# Altium schematic sheet CONNECTEUR_1.SchDoc: DARKYDEN_CONNECTEUR_1
size Letter; ApprovedBy: APPROUVÉ PAR; Author: Harold Malbrouck; Organization: Cegep Limoilou; Address1: 1300, 8e Avenue; Address2: Québec, QC; Address3: Canada; Address4: G1J 5L5; Revision: Rev.B; SheetNumber: 3; SheetTotal: 21
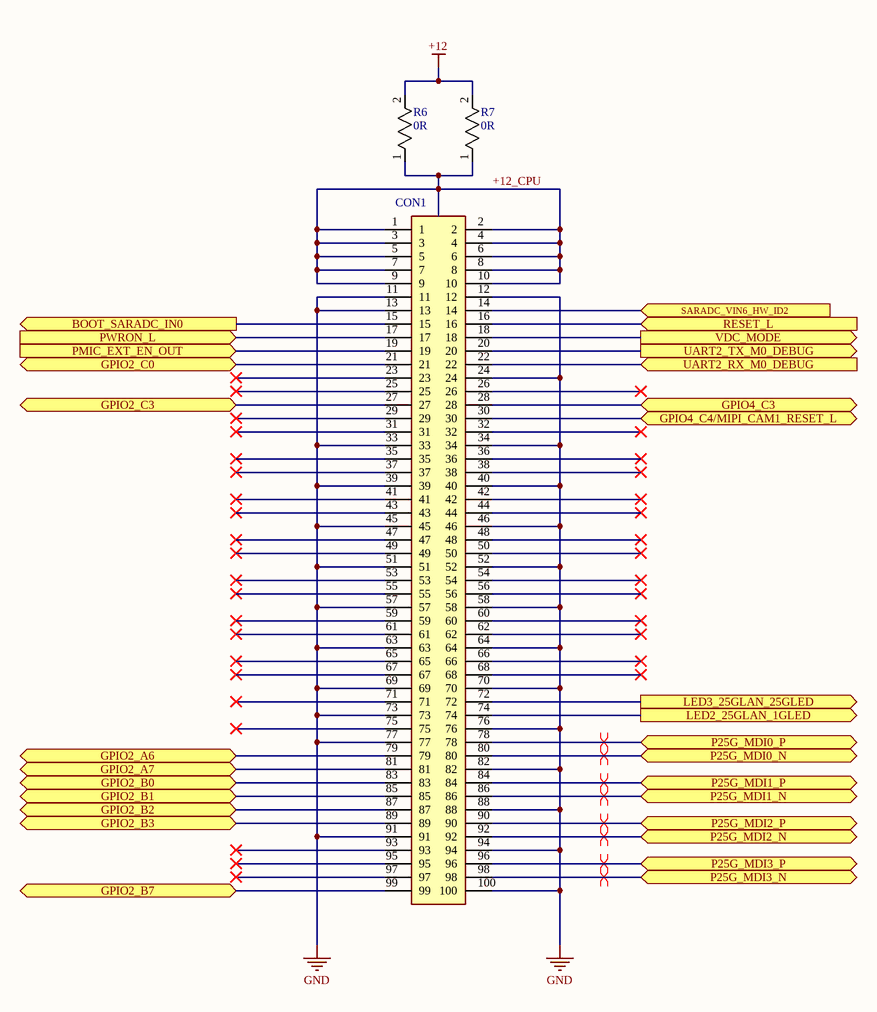
[diagram p0: CONNECTEUR_1.SchDoc]

## Parts
CON1  DF40HC  [DF40HC30100DS04V51_MOD]  (value not drawn)
R6  0R  [RESC1608X55N]
R7  0R  [RESC1608X55N]

## Ports
BOOT_SARADC_IN0 (out, see SystemCTL[1B]), GPIO2_A6 (bidir, see WIFI[1B]), GPIO2_A7 (bidir, see WIFI[1B]), GPIO2_B0 (bidir, see WIFI[1B]), GPIO2_B1 (bidir, see WIFI[1B]), GPIO2_B2 (bidir, see WIFI[1B]), GPIO2_B3 (bidir, see WIFI[1A]), GPIO2_B7 (bidir, see WIFI[3A]), GPIO2_C0 (bidir, see WIFI[3A]), GPIO2_C3 (bidir, see WIFI[3B]), GPIO4_C3 (bidir, see WIFI[3B]), GPIO4_C4/MIPI_CAM1_RESET_L (bidir, see WIFI[3B]), LED2_25GLAN_1GLED (out, see ETHERNET[3A]), LED3_25GLAN_25GLED (out, see ETHERNET[3B]), P25G_MDI0_N (bidir, see ETHERNET[2C]), P25G_MDI0_P (bidir, see ETHERNET[2B]), P25G_MDI1_N (bidir, see ETHERNET[4B]), P25G_MDI1_P (bidir, see ETHERNET[4C]), P25G_MDI2_N (bidir, see ETHERNET[2C]), P25G_MDI2_P (bidir, see ETHERNET[2C]), P25G_MDI3_N (bidir, see ETHERNET[4C]), P25G_MDI3_P (bidir, see ETHERNET[4C]), PMIC_EXT_EN_OUT (in, see 1V8_3V3_5V[1A], 1V8_3V3_5V[1C], POWER_PCie[1B], POWER_PCie[1C]), PWRON_L (in, see SystemCTL[1A]), RESET_L (in, see SystemCTL[1B]), SARADC_VIN6_HW_ID2 (in, see USB2_0_Connector[3A]), UART2_RX_M0_DEBUG (in, see SystemCTL[2D]), UART2_TX_M0_DEBUG (out, see SystemCTL[2D]), VDC_MODE (out, see SystemCTL[1D])

## Nets
+12: R6.2 R7.2
GND: CON1.11 CON1.12 CON1.13 CON1.24 CON1.33 CON1.34 CON1.39 CON1.40 CON1.45 CON1.46 CON1.51 CON1.52 CON1.57 CON1.58 CON1.63 CON1.64 CON1.69 CON1.70 CON1.73 CON1.76 CON1.77 CON1.82 CON1.88 CON1.91 CON1.94 CON1.100
+12_CPU: CON1.1 CON1.2 CON1.3 CON1.4 CON1.5 CON1.6 CON1.7 CON1.8 CON1.9 CON1.10 R6.1 R7.1
BOOT_SARADC_IN0: CON1.15 ; port BOOT_SARADC_IN0
GPIO2_A6: CON1.79 ; port GPIO2_A6
GPIO2_A7: CON1.81 ; port GPIO2_A7
GPIO2_B0: CON1.83 ; port GPIO2_B0
GPIO2_B1: CON1.85 ; port GPIO2_B1
GPIO2_B2: CON1.87 ; port GPIO2_B2
GPIO2_B3: CON1.89 ; port GPIO2_B3
GPIO2_B7: CON1.99 ; port GPIO2_B7
GPIO2_C0: CON1.21 ; port GPIO2_C0
GPIO2_C3: CON1.27 ; port GPIO2_C3
GPIO4_C3: CON1.28 ; port GPIO4_C3
GPIO4_C4/MIPI_CAM1_RESET_L: CON1.30 ; port GPIO4_C4/MIPI_CAM1_RESET_L
LED2_25GLAN_1GLED: CON1.74 ; port LED2_25GLAN_1GLED
LED3_25GLAN_25GLED: CON1.72 ; port LED3_25GLAN_25GLED
P25G_MDI0_N: CON1.80 ; port P25G_MDI0_N
P25G_MDI0_P: CON1.78 ; port P25G_MDI0_P
P25G_MDI1_N: CON1.86 ; port P25G_MDI1_N
P25G_MDI1_P: CON1.84 ; port P25G_MDI1_P
P25G_MDI2_N: CON1.92 ; port P25G_MDI2_N
P25G_MDI2_P: CON1.90 ; port P25G_MDI2_P
P25G_MDI3_N: CON1.98 ; port P25G_MDI3_N
P25G_MDI3_P: CON1.96 ; port P25G_MDI3_P
PMIC_EXT_EN_OUT: CON1.19 ; port PMIC_EXT_EN_OUT
PWRON_L: CON1.17 ; port PWRON_L
RESET_L: CON1.16 ; port RESET_L
SARADC_VIN6_HW_ID2: CON1.14 ; port SARADC_VIN6_HW_ID2
UART2_RX_M0_DEBUG: CON1.22 ; port UART2_RX_M0_DEBUG
UART2_TX_M0_DEBUG: CON1.20 ; port UART2_TX_M0_DEBUG
VDC_MODE: CON1.18 ; port VDC_MODE

Not connected (* = marked no-connect by the designer): CON1 23* 25* 26* 29* 31* 32* 35* 36* 37* 38* 41* 42* 43* 44* 47* 48* 49* 50* 53* 54* 55* 56* 59* 60* 61* 62* 65* 66* 67* 68* 71* 75* 93* 95* 97*

## Layout directives
differential pair: P25G_MDI0_N, P25G_MDI0_P, P25G_MDI1_N, P25G_MDI1_P, P25G_MDI2_N, P25G_MDI2_P, P25G_MDI3_N, P25G_MDI3_P

## Notes on the sheet
- Titre :
- Conception :
- Date :
- Approbation :
- Heure :
- Révision :
- Feuille
- de
- Fichier :

## Library data of the parts
CON1 = DF40HC(3.0)-100DS-0.4V(51): Stacking Board Connector, DF40 Series, Receptacle, 0.4 mm, 100, Surface Mount, G; Manufacturer_Name: Hirose; Number of Positions: 100; Contact Resistance: 90mR; Contact Voltage Rating (AC): 30V; Current Rating: 300mA; Mated Stacking Heights: 3mm; Contact Pitch: 400um; Datasheet Link: https://componentsearchengine.com/Datasheets/1/DF40HC(3.0)-100DS-0.4V(51.pdf; Height: 3.05mm; Mouser Part Number: 798-DF40HC30100DS451; Mouser Price/Stock: https://www.mouser.co.uk/ProductDetail/Hirose-Connector/DF40HC3.0-100DS-0.4V51?qs=%252BAZVS4b%2FkgIV%252B3vHYy2dCA%3D%3D; Arrow Part Number: DF40HC(3.0)-100DS-0.4V(51; Arrow Price/Stock: https://www.arrow.com/en/products/df40hc-3.0-100ds-0.4v-51/hirose-electric; Supplier: Digikey; Supplier Part Number: 26-DF40HC(3.0)-100DS-0.4V(51)CT-ND; Manufacturer: Hirose; Manufacturer Part Number: DF40HC(3.0)-100DS-0.4V(51; RoHS: Yes; Category: Headers and Wire Housings; Stock: 5604; Pricing: 1=2.61, 10=2.219, 25=2.0796, 50=1.9804, 100=1.8858, 250=1.76764, 500=1.68326, 1000=1.6524 (USD); Mounting Technology: Surface Mount; Contact Plating: Gold; Contact Material: Nickel,Gold; Housing Color: Black; Min Operating Temperature: -35°C; Max Operating Temperature: 85°C; Package Quantity: 3000; Packaging: Tape and Reel; Number of Rows: 2; Connector Type: Receptacle; Series: DF40; Contact Voltage Rating (DC): 30V; Number of Contacts: 100; Orientation: Straight; Voltage Rating: 30V; Length: 22.6mm; Width: 3.38mm; ComponentLink1URL: https://datasheet.ciiva.com/13559/ed-df40-20140305-13559540.pdf?src-supplier=Mouser; ComponentLink1Description: https://datasheet.ciiva.com/13559/ed-df40-20140305-13559540.pdf?src-supplier=Mouser
R6 R7 = ERJ-3GEY0R00V: Zero Ohm Resistor, Jumper, 0603 [1608 Metric], Thick Film, 100 mW, 1 A, Surface Mount; Manufacturer_Name: Panasonic; Power Rating: 100mW; Voltage Rating: 75V; Tolerance: 0%; Temperature Coefficient: 200ppm/°C; Datasheet Link: http://docs-europe.electrocomponents.com/webdocs/13ba/0900766b813ba21b.pdf; Height: 0.55mm; Mouser Part Number: 667-ERJ-3GEY0R00V; Mouser Price/Stock: https://www.mouser.co.uk/ProductDetail/Panasonic/ERJ-3GEY0R00V?qs=66DK8nO8gJALIOqOWgiVwg%3D%3D; Arrow Part Number: ERJ-3GEY0R00V; Arrow Price/Stock: https://www.arrow.com/en/products/erj3gey0r00v/panasonic?region=europe; Supplier: Digikey; Supplier Part Number: P0.0GCT-ND; Manufacturer: Panasonic; Manufacturer Part Number: ERJ-3GEY0R00V; RoHS: Yes; Category: Chip SMD Resistors; Stock: 766631; Pricing: 1=0.1, 10=0.02, 25=0.0164, 50=0.0144, 100=0.0126, 250=0.0106, 500=0.00936, 1000=0.0083 (USD); Mounting Technology: Surface Mount; Case/Package: 0603; Case Code (Metric): 1608; Case Code (Imperial): 0603; Contact Plating: Tin; Min Operating Temperature: -55°C; Max Operating Temperature: 155°C; Packaging: Tape and Reel; Package Quantity: 5000; Value: 0R; Resistor Type: Thick Film; Number of Terminations: 2; Termination: SMD/SMT; Max Power Dissipation: 100mW; Features: Automotive AEC-Q200; Series: ERJ; Construction: Rectangular; Technology: THICK FILM; Length: 1.6mm; Width: 0.8mm; Depth: 0.8mm; Ratings: AEC-Q200; Radiation Hardening: No; Reach SVHC Compliant: No; Military Standard: Not; RoHS Compliant: Yes; Lead Free: 5697LeadFree; ComponentLink1URL: https://datasheet.ciiva.com/11808/0900766b80f806dd-11808207.pdf?src-supplier=Rs; ComponentLink1Description: https://datasheet.ciiva.com/11808/0900766b80f806dd-11808207.pdf?src-supplier=Rs; ComponentLink2URL: https://datasheet.ciiva.com/27055/1935748-27055113.pdf?src-supplier=Jameco; ComponentLink2Description: https://datasheet.ciiva.com/27055/1935748-27055113.pdf?src-supplier=Jameco; ComponentLink3URL: https://datasheet.ciiva.com/5959/1678796-5959707.pdf?src-supplier=Farnell; ComponentLink3Description: https://datasheet.ciiva.com/5959/1678796-5959707.pdf?src-supplier=Farnell; ComponentLink4URL: https://datasheet.ciiva.com/43460/1678796-43460647.pdf?src-supplier=Farnell; ComponentLink4Description: https://datasheet.ciiva.com/43460/1678796-43460647.pdf?src-supplier=Farnell; ComponentLink5URL: https://datasheet.ciiva.com/48532/aoa0000ce1-48532165.pdf?src-supplier=Avnet; ComponentLink5Description: https://datasheet.ciiva.com/48532/aoa0000ce1-48532165.pdf?src-supplier=Avnet; ComponentLink6URL: https://datasheet.ciiva.com/28695/1678796-28695833.pdf?src-supplier=Element14; ComponentLink6Description: https://datasheet.ciiva.com/28695/1678796-28695833.pdf?src-supplier=Element14; ComponentLink7URL: https://datasheet.ciiva.com/16834/aoa0000ce1-16834828.pdf?src-supplier=Future+Electronics; ComponentLink7Description: https://datasheet.ciiva.com/16834/aoa0000ce1-16834828.pdf?src-supplier=Future+Electronics; ComponentLink8URL: https://datasheet.ciiva.com/16758/70255313-16758527.pdf?src-supplier=Allied+Electronics; ComponentLink8Description: https://datasheet.ciiva.com/16758/70255313-16758527.pdf?src-supplier=Allied+Electronics; ComponentLink9URL: https://datasheet.ciiva.com/30199/4aoa0000ce1-30199822.pdf?src-supplier=Onlinecomponents.com; ComponentLink9Description: https://datasheet.ciiva.com/30199/4aoa0000ce1-30199822.pdf?src-supplier=Onlinecomponents.com; ComponentLink10URL: https://datasheet.ciiva.com/46377/1678796-46377868.pdf?src-supplier=Element14; ComponentLink10Description: https://datasheet.ciiva.com/46377/1678796-46377868.pdf?src-supplier=Element14; ComponentLink11URL: https://datasheet.ciiva.com/9198/aoa0000ce1-9198975.pdf?src-supplier=Avnet; ComponentLink11Description: https://datasheet.ciiva.com/9198/aoa0000ce1-9198975.pdf?src-supplier=Avnet